# EasyEDA Pro project 数字电路实验接线.eprj

# Schematic Schematic1
Create Date: 2023-10-21; Page Name: P1; Project Name: 数字电路实验接线; Schematic Name: Schematic1; Update Date: 2023-10-21; Company: 嘉立创EDA; Page Size: A4; Version: V1.0
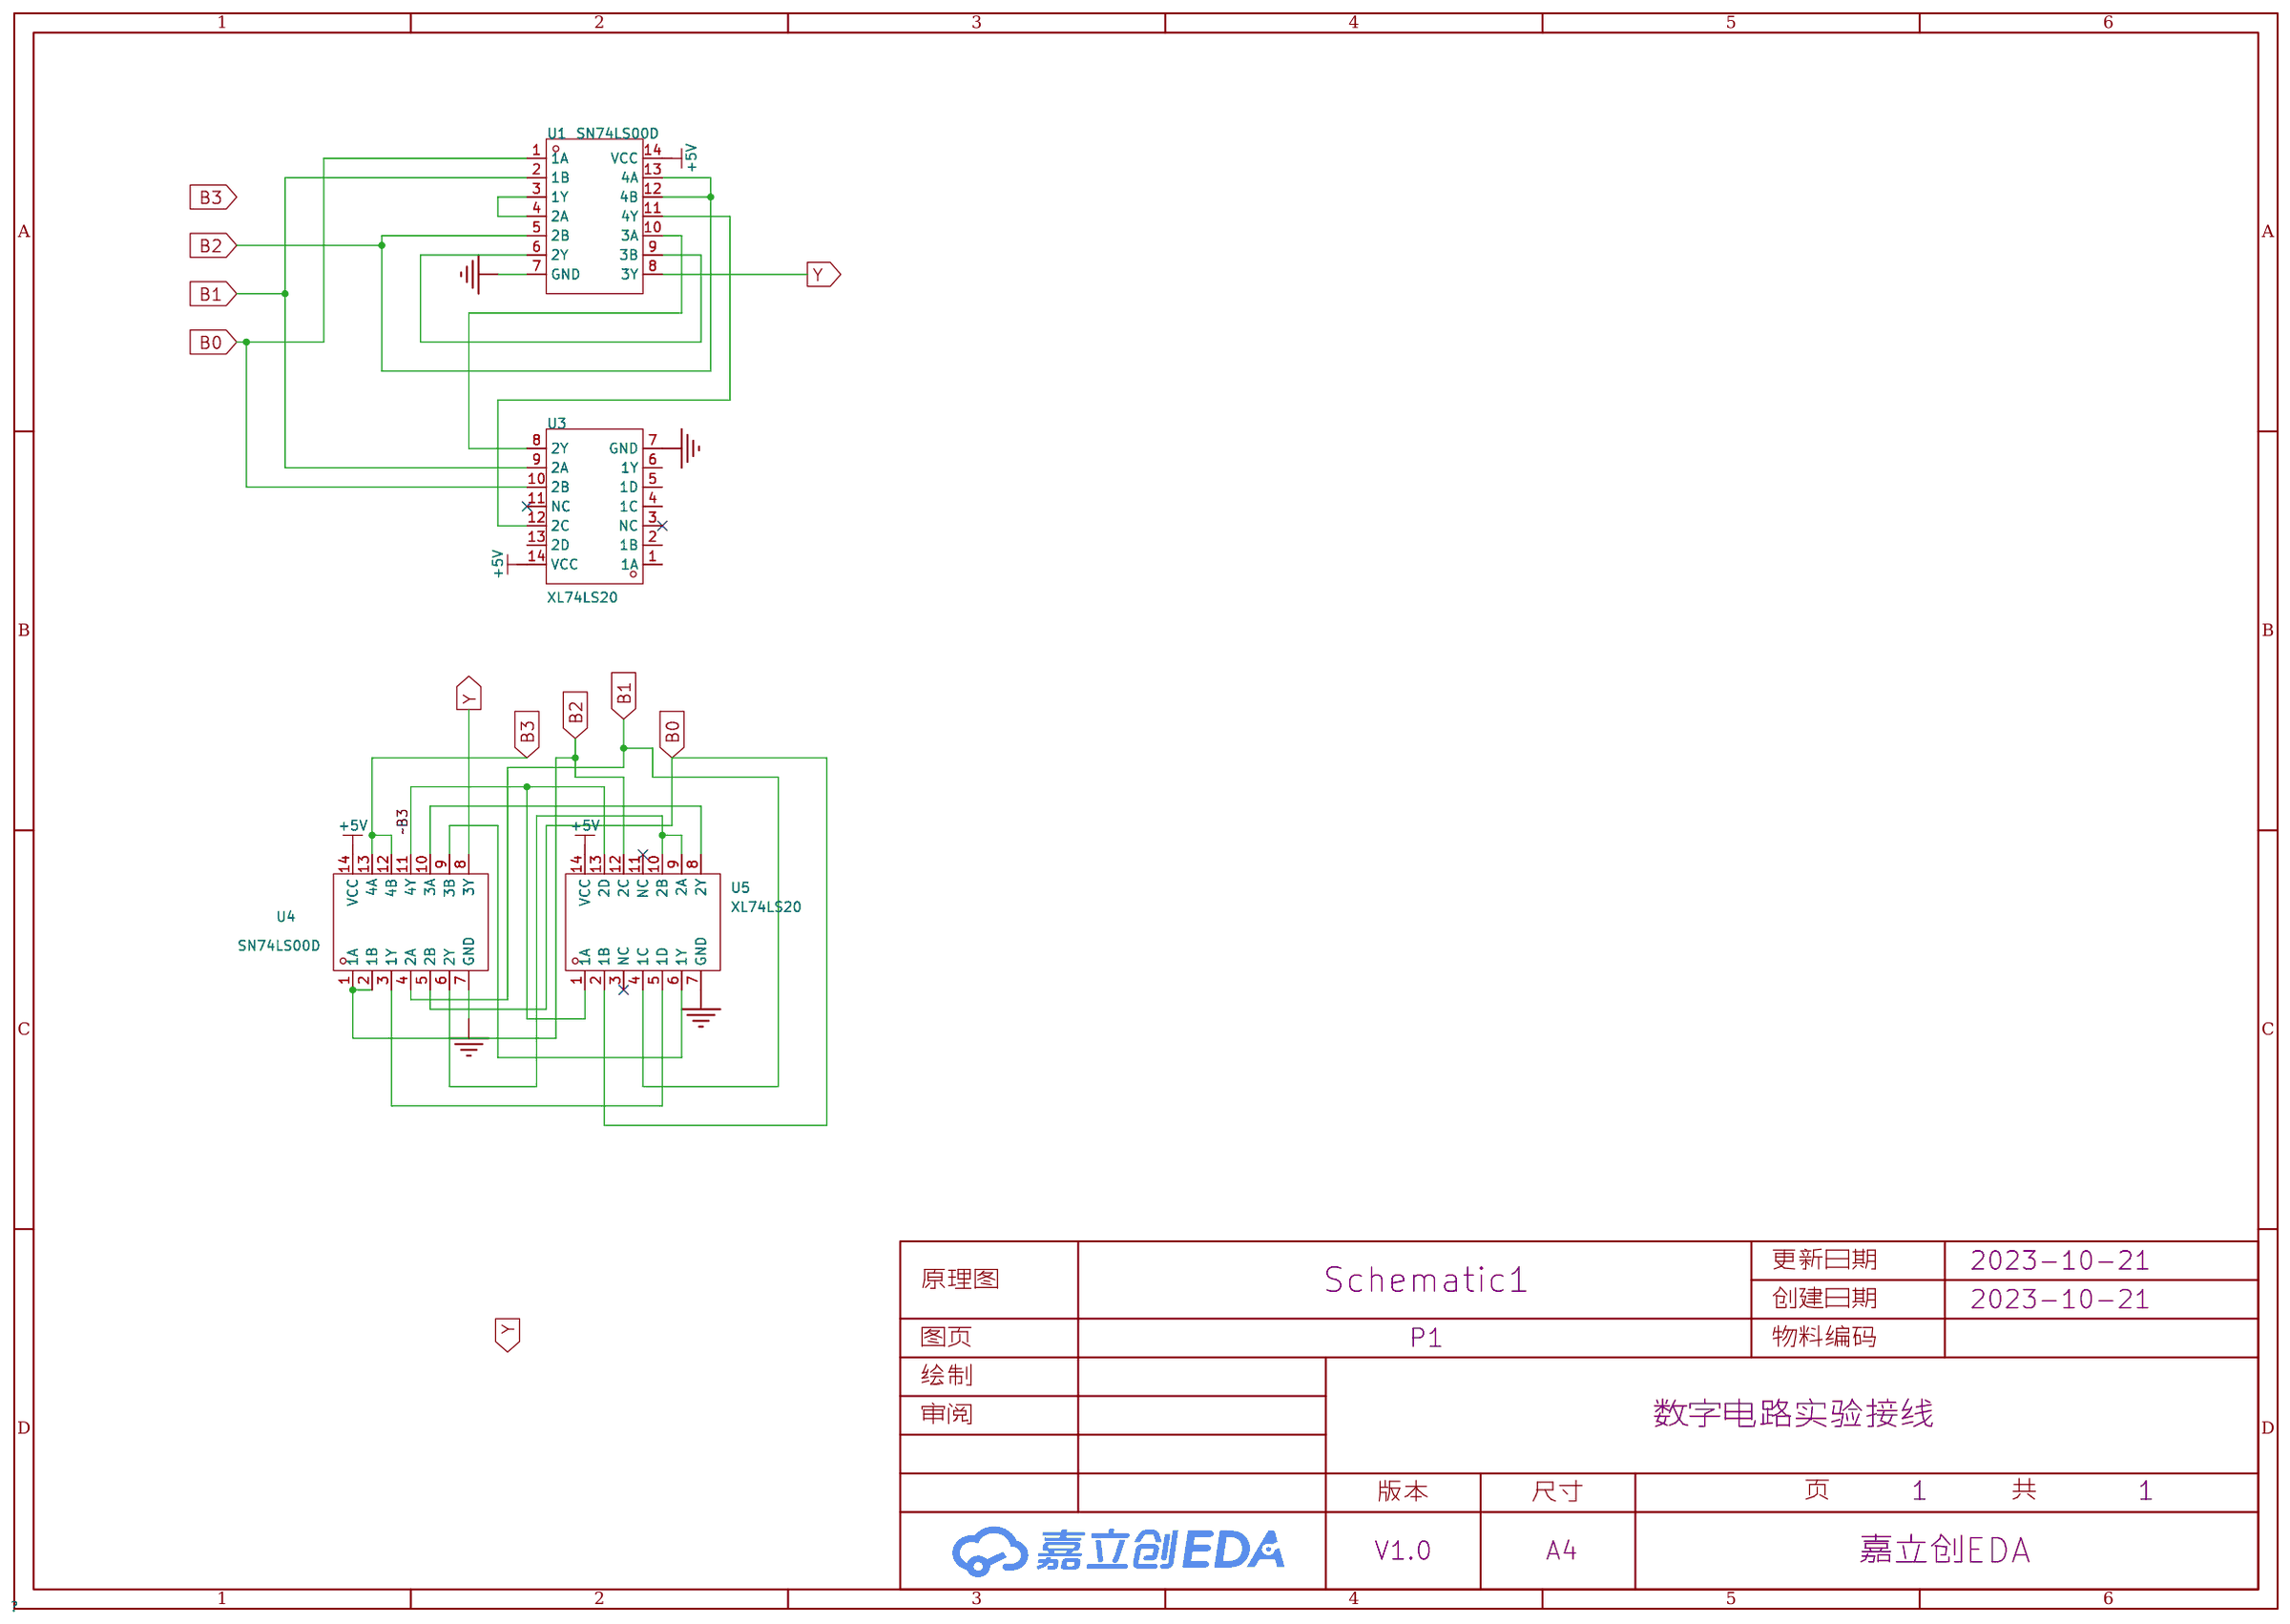
[diagram p0: schematic sheet]

## Parts
U1  SN74LS00D  [SOIC-14_L8.7-W3.9-P1.27-LS6.0-BL]
U3  XL74LS20  [SOP-14_L8.6-W3.9-P1.27-LS6.0-BL]
U4  SN74LS00D  [SOIC-14_L8.7-W3.9-P1.27-LS6.0-BL]
U5  XL74LS20  [SOP-14_L8.6-W3.9-P1.27-LS6.0-BL]

## Library data of the parts
U1 U4 = SN74LS00D: 4 通道、2 输入、4.75V 至 5.25V 双极与非门 14-SOIC 0 to 70; Supplier Part: C2872907; Manufacturer: TI(德州仪器); Supplier Footprint: SOIC-14; JLCPCB Part Class: Extended Part; Datasheet: https://atta.szlcsc.com/upload/public/pdf/source/20230221/2481733E2F3EBD7DE0CC3CA8D850DB3A.pdf; Supplier: LCSC
U3 U5 = XL74LS20: 逻辑电路的归属系列:-;逻辑类型:-;; Supplier Part: C556253; Manufacturer: XINLUDA(信路达); Supplier Footprint: SOP-14; JLCPCB Part Class: Extended Part; Datasheet: https://atta.szlcsc.com/upload/public/pdf/source/20200519/C556253_E0C015BCE649D942C076C1CD34C81B1C.pdf; Supplier: LCSC

## Nets
+5V: U1.14(VCC) U3.14(VCC) U4.14(VCC) U5.14(VCC)
GND: U1.7(GND) U3.7(GND) U4.7(GND) U5.7(GND)
B0: U1.1(1A) U3.10(2B) U4.5(2B) U5.2(1B)
B1: U1.2(1B) U3.9(2A) U4.4(2A) U5.4(1C)
B2: U1.5(2B) U1.12(4B) U1.13(4A) U4.1(1A) U4.2(1B) U5.12(2C)
B3: U4.12(4B) U4.13(4A)
Y: U1.8(3Y) U4.8(3Y)
~B3: U4.11(4Y) U5.1(1A) U5.13(2D)
Net-(U1-3): U1.3(1Y) U1.4(2A)
Net-(U1-6): U1.6(2Y) U1.9(3B)
Net-(U1-10): U1.10(3A) U3.8(2Y)
Net-(U1-11): U1.11(4Y) U3.12(2C)
Net-(U4-3): U4.3(1Y) U5.5(1D)
Net-(U4-6): U4.6(2Y) U5.9(2A) U5.10(2B)
Net-(U4-9): U4.9(3B) U5.6(1Y)
Net-(U4-10): U4.10(3A) U5.8(2Y)

Not connected (* = marked no-connect by the designer): U3 1(1A) 2(1B) 3(NC)* 4(1C) 5(1D) 6(1Y) 11(NC)* 13(2D); U5 3(NC)* 11(NC)*

# Schematic Schematic2
Create Date: 2023-10-29; Page Name: P1; Project Name: 数字电路实验接线; Schematic Name: Schematic2; Update Date: 2023-10-29; Company: 嘉立创EDA; Page Size: A4; Version: V1.0
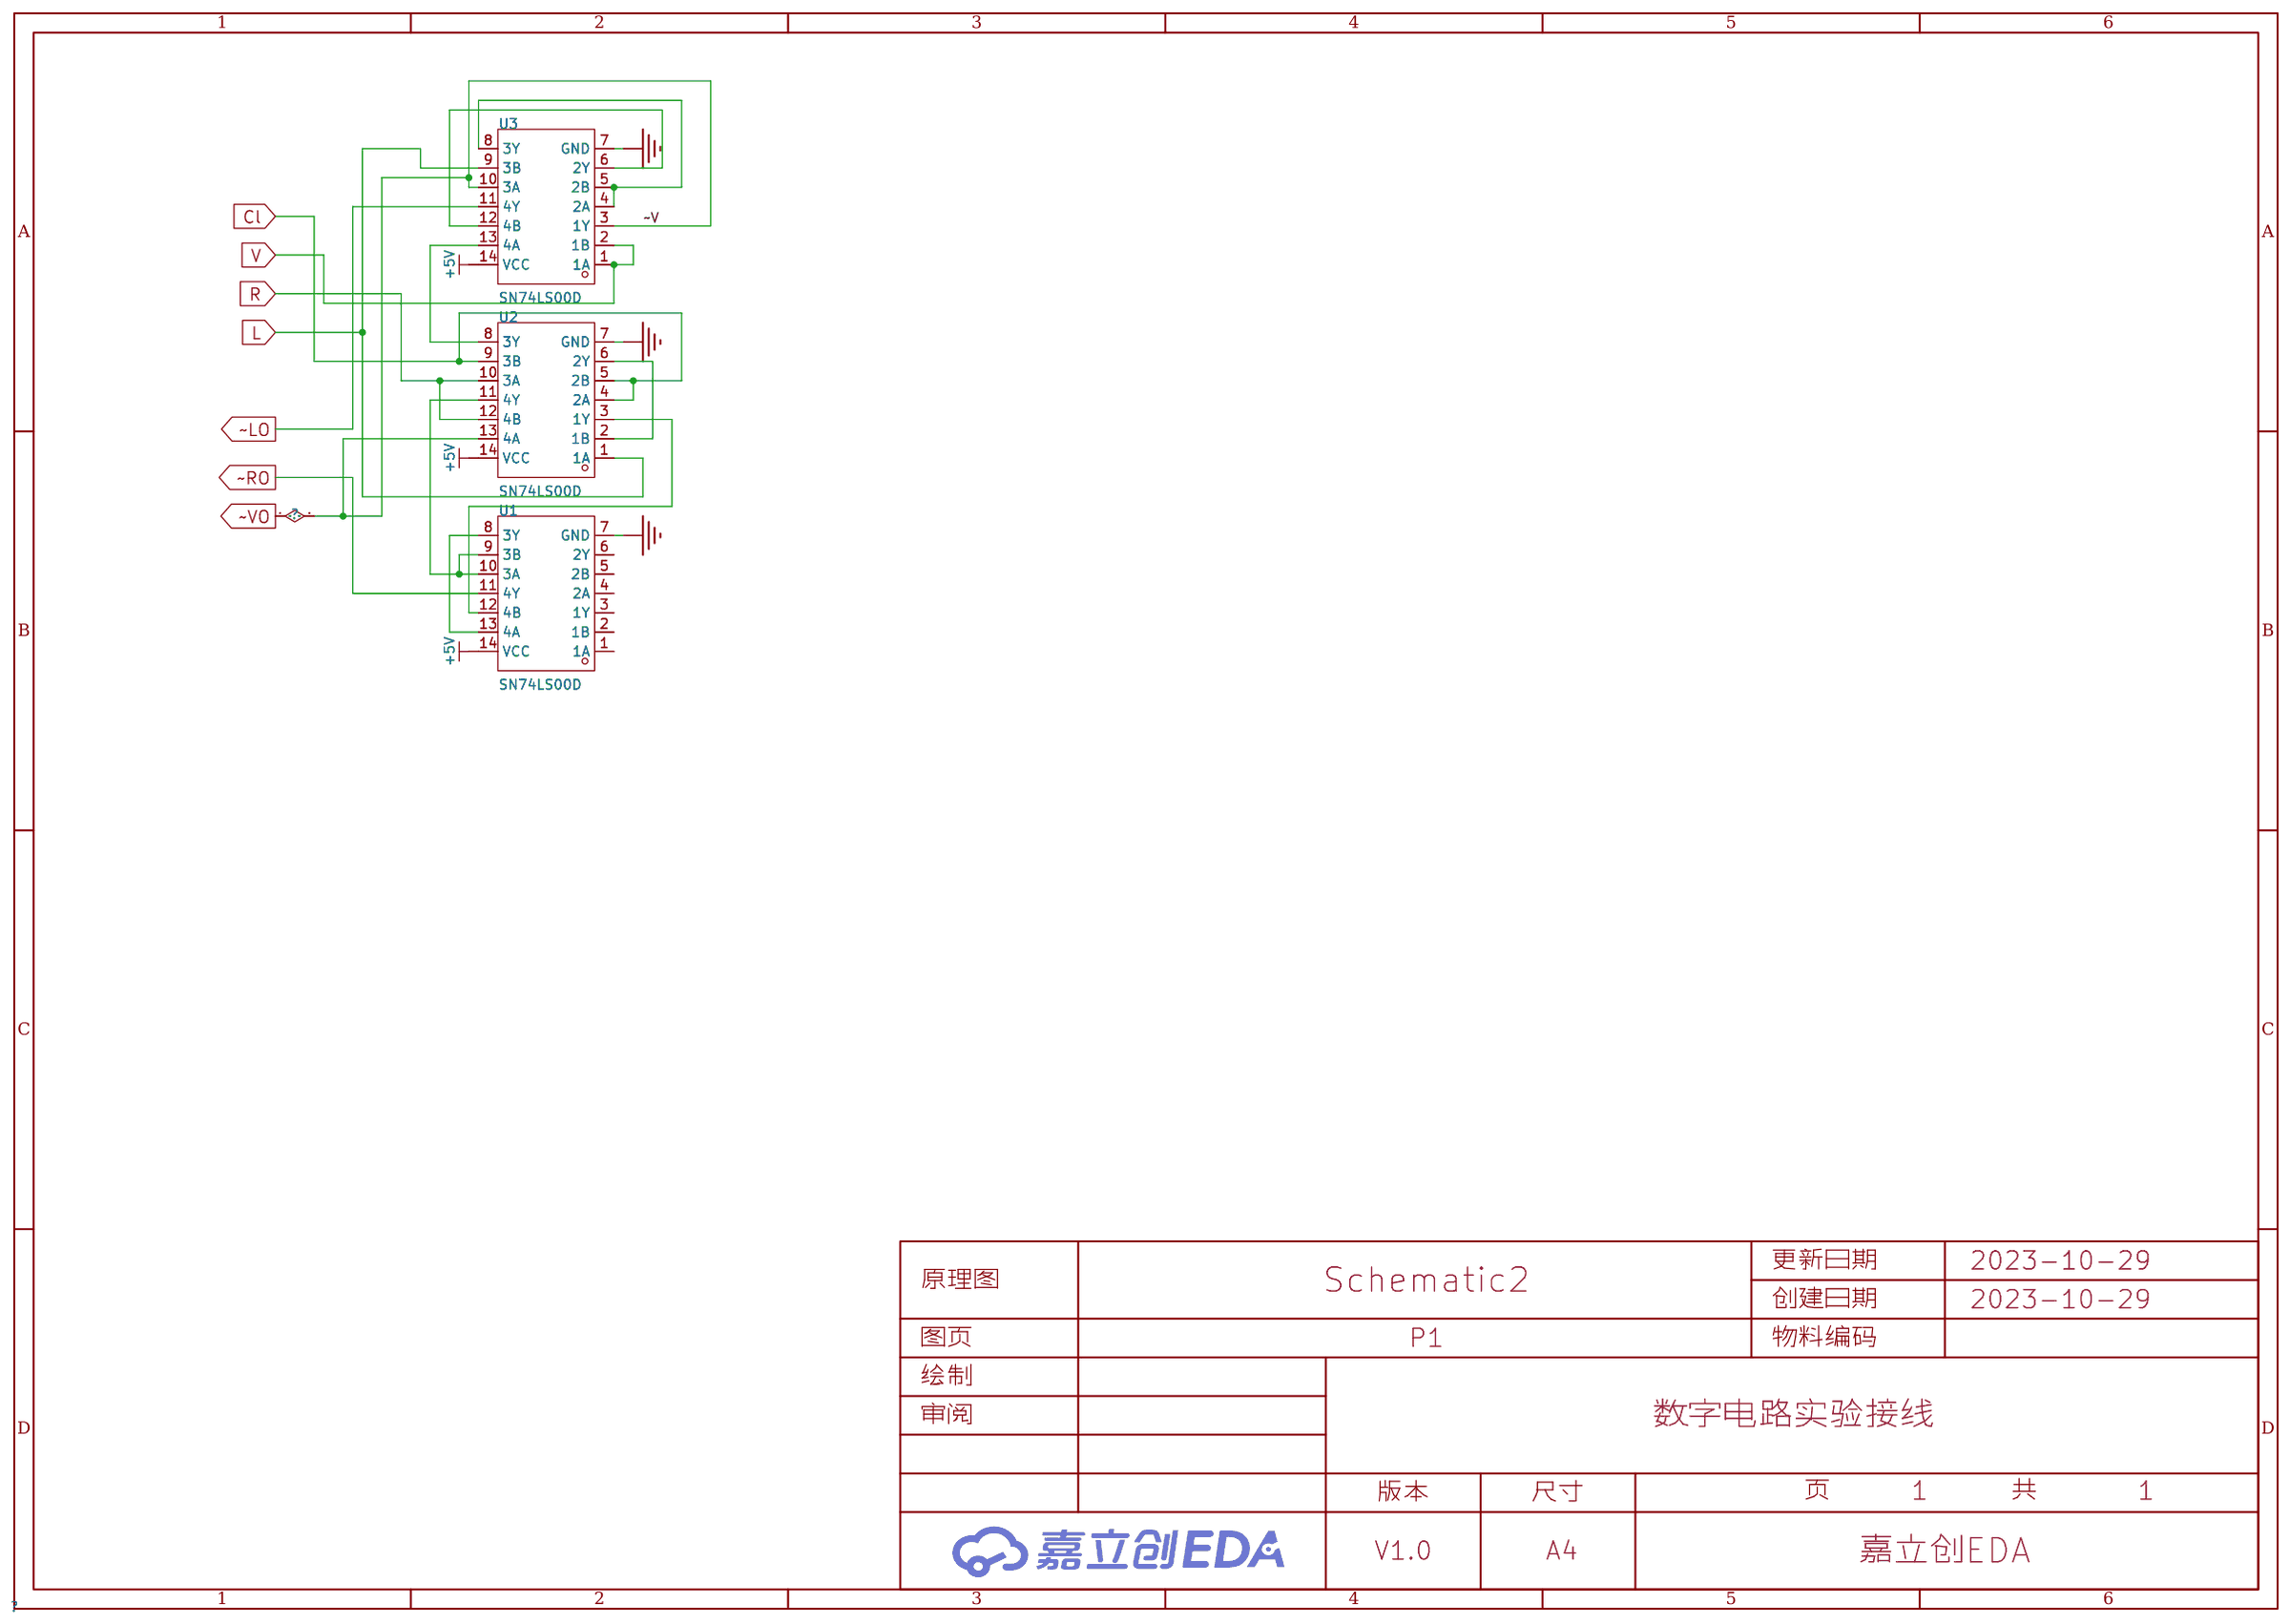
[diagram p1: schematic sheet]

## Parts
U1  SN74LS00D  [SOIC-14_L8.7-W3.9-P1.27-LS6.0-BL]
U2  SN74LS00D  [SOIC-14_L8.7-W3.9-P1.27-LS6.0-BL]
U3  SN74LS00D  [SOIC-14_L8.7-W3.9-P1.27-LS6.0-BL]

## Library data of the parts
U1-U3 = SN74LS00D: 4 通道、2 输入、4.75V 至 5.25V 双极与非门 14-SOIC 0 to 70; Supplier Part: C2872907; Manufacturer: TI(德州仪器); Supplier Footprint: SOIC-14; JLCPCB Part Class: Extended Part; Datasheet: https://atta.szlcsc.com/upload/public/pdf/source/20230221/2481733E2F3EBD7DE0CC3CA8D850DB3A.pdf; Supplier: LCSC

## Nets
+5V: U1.14(VCC) U2.14(VCC) U3.14(VCC)
GND: U1.7(GND) U2.7(GND) U3.7(GND)
Cl: U2.4(2A) U2.5(2B) U2.9(3B)
L: U2.1(1A) U3.9(3B)
R: U2.10(3A) U2.12(4B)
V: U3.1(1A) U3.2(1B)
~LO: U3.11(4Y)
~RO: U1.11(4Y)
~V: U2.13(4A) U3.3(1Y) U3.10(3A)
Net-(U1-8): U1.8(3Y) U1.13(4A)
Net-(U1-9): U1.9(3B) U1.10(3A) U2.11(4Y)
Net-(U1-12): U1.12(4B) U2.3(1Y)
Net-(U2-2): U2.2(1B) U2.6(2Y)
Net-(U2-8): U2.8(3Y) U3.13(4A)
Net-(U3-4): U3.4(2A) U3.5(2B) U3.8(3Y)
Net-(U3-6): U3.6(2Y) U3.12(4B)

Not connected (* = marked no-connect by the designer): U1 1(1A) 2(1B) 3(1Y) 4(2A) 5(2B) 6(2Y)

# Schematic Schematic3
Create Date: 2023-11-05; Page Name: P1; Project Name: 数字电路实验接线; Schematic Name: Schematic3; Update Date: 2023-11-05; Company: 嘉立创EDA; Page Size: A4; Version: V1.0
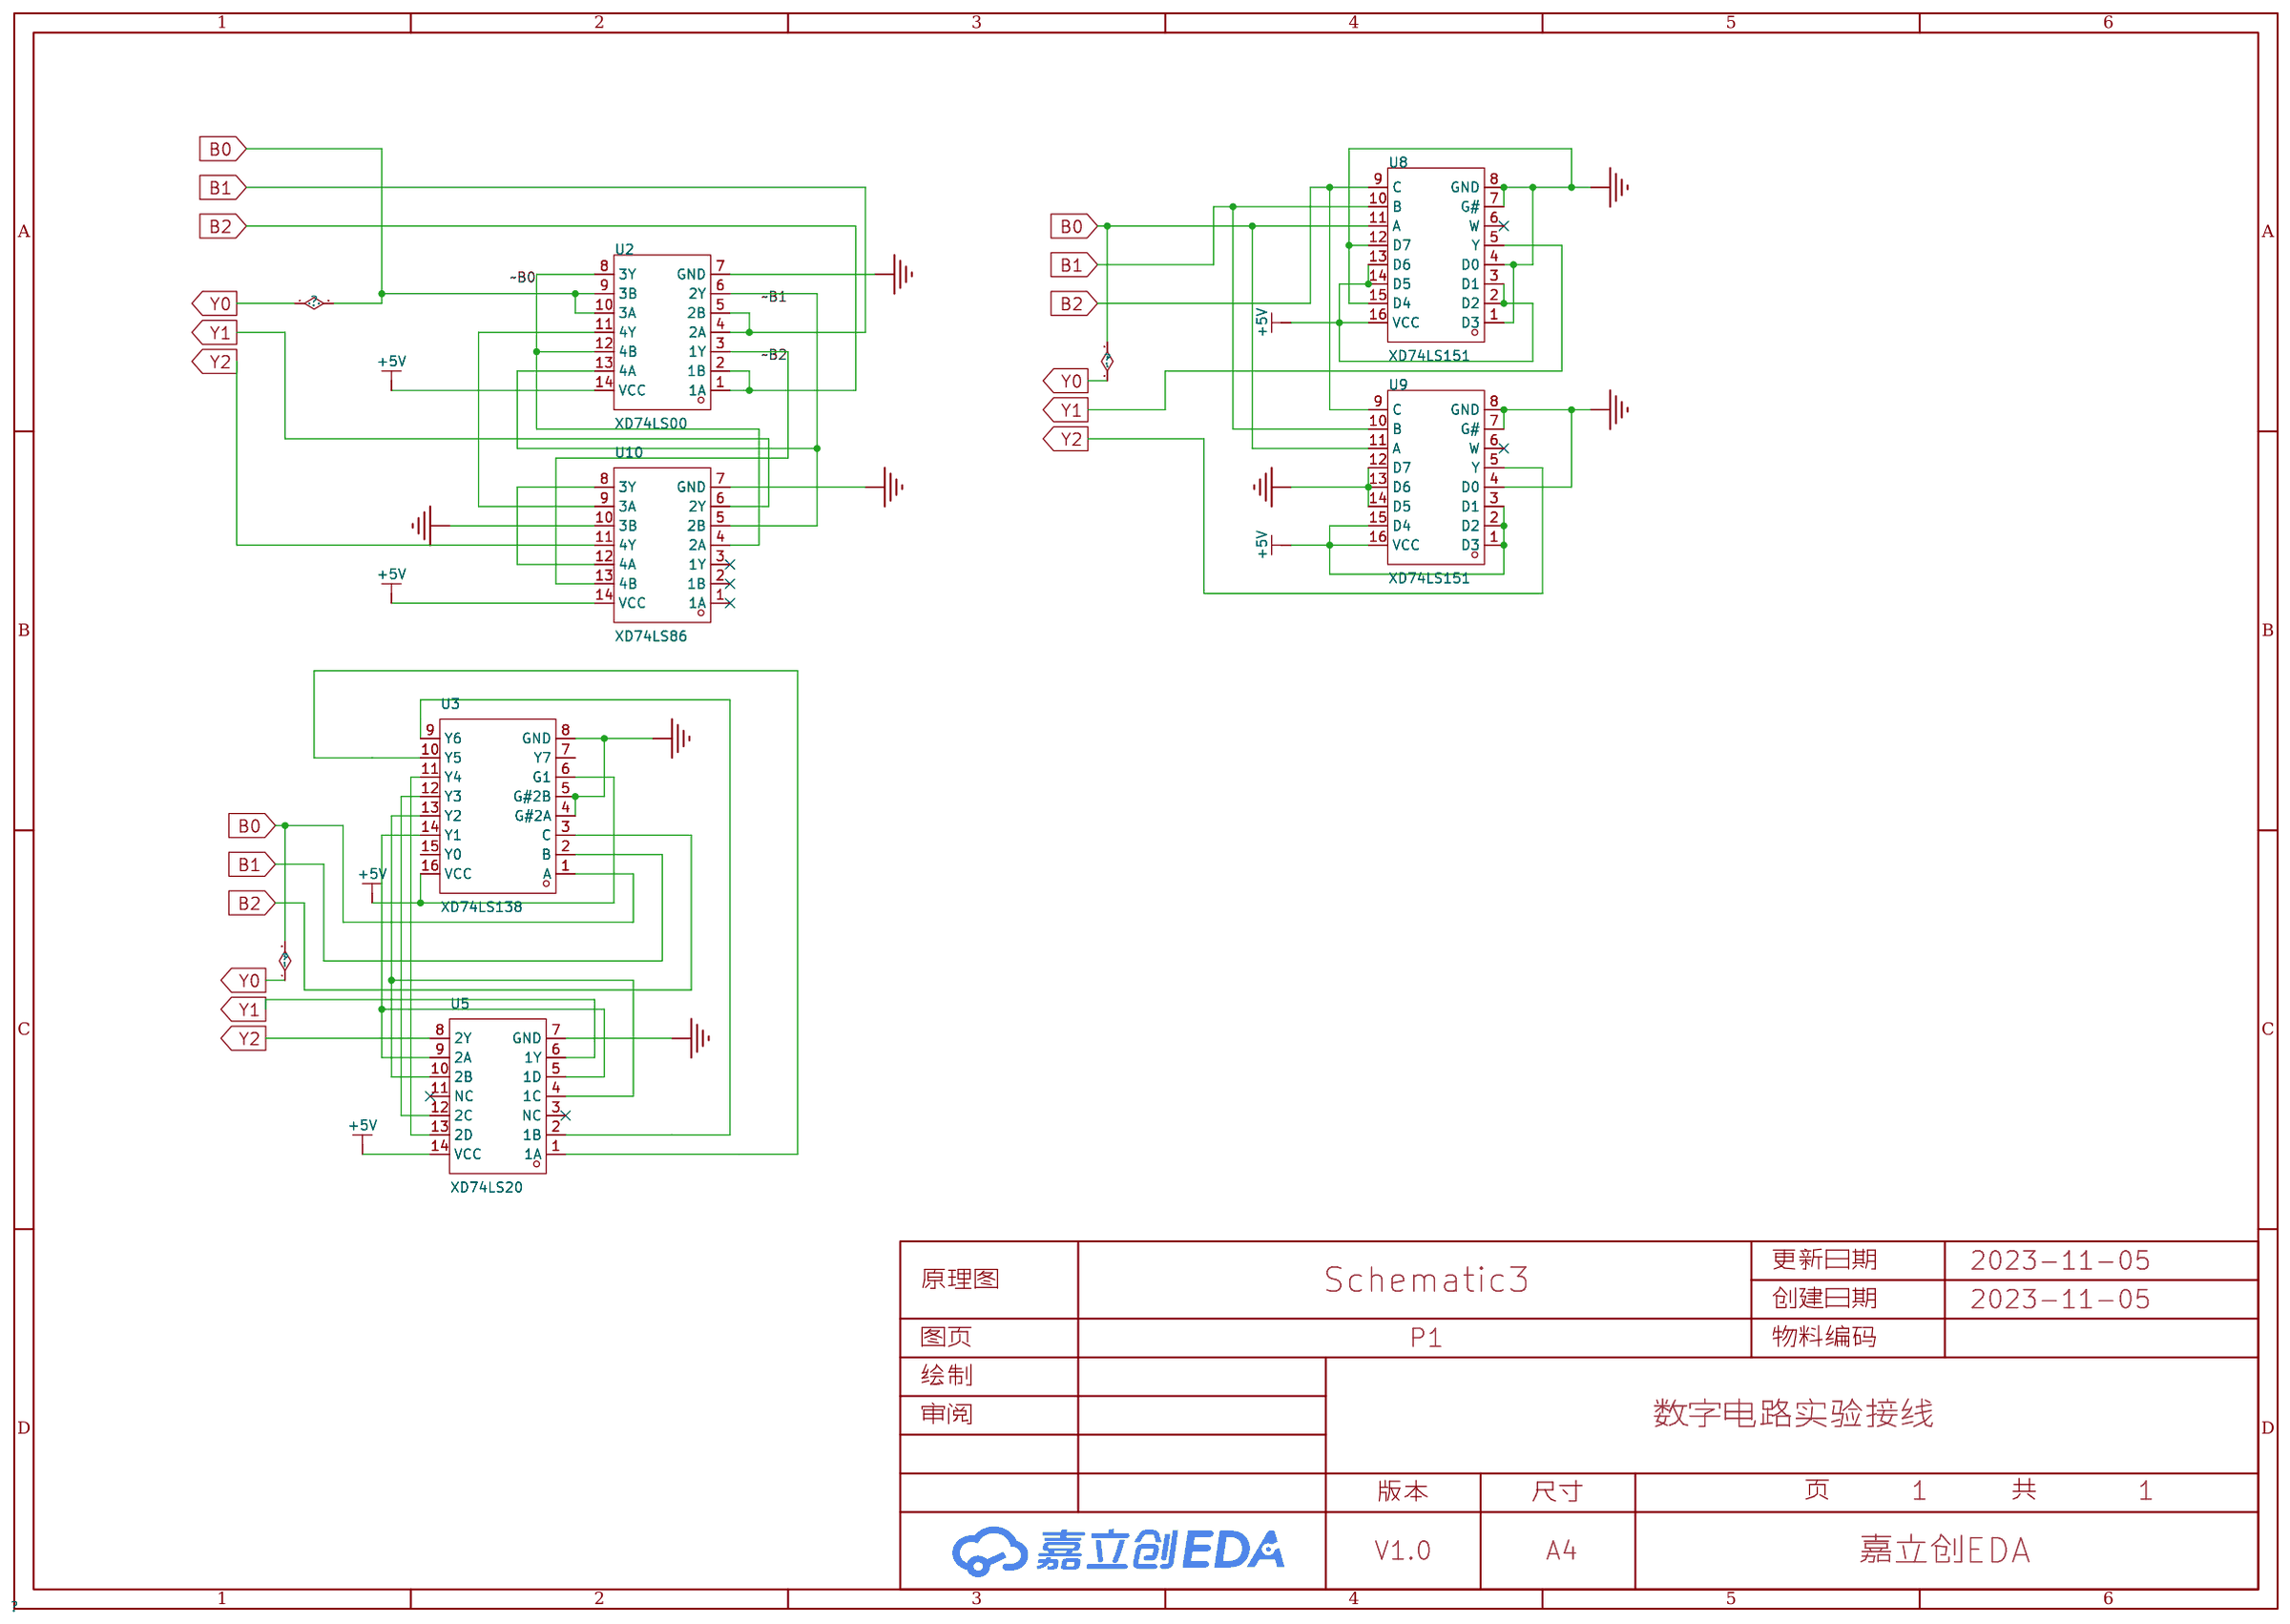
[diagram p2: schematic sheet]

## Parts
U2  XD74LS00  [DIP-14_L20.0-W7.6-P2.54-LS7.6-BL]
U3  XD74LS138  [DIP-16_L19.8-W6.5-P2.54-LS7.6-BL]
U5  XD74LS20  [DIP-14_L20.0-W7.6-P2.54-LS7.6-BL]
U8  XD74LS151  [DIP-16_L19.8-W6.5-P2.54-LS7.6-BL]
U9  XD74LS151  [DIP-16_L19.8-W6.5-P2.54-LS7.6-BL]
U10  XD74LS86  [DIP-14_L20.0-W7.6-P2.54-LS7.6-BL]

## Library data of the parts
U2 = XD74LS00: 逻辑电路的归属系列:-;逻辑类型:-;; Supplier Part: C556265; Manufacturer: XINLUDA(信路达); Supplier Footprint: DIP-14; JLCPCB Part Class: 扩展库; Datasheet: https://atta.szlcsc.com/upload/public/pdf/source/20200619/C556265_13CAEE68E18239D5629B1CE05D0196F6.pdf; Supplier: LCSC
U3 = XD74LS138: 解码器/多路解器 低电平输出电流(IOL)：8mA 高电平输出电流(IOH)：400uA 供电电源：单电源 供电电压：4.75V~5.25V 3 线路到; LCSC Part Name: 编码器、解码器、复用器和解复用器; Supplier Part: C513527; Manufacturer: XINLUDA(信路达); Supplier Footprint: DIP-16; JLCPCB Part Class: 扩展库; Datasheet: https://atta.szlcsc.com/upload/public/pdf/source/20200619/C513527_D04113946337FFA11528F3555AE2E14A.pdf; Supplier: LCSC
U5 = XD74LS20: 逻辑电路的归属系列:-;逻辑类型:-;; Supplier Part: C556254; Manufacturer: XINLUDA(信路达); Supplier Footprint: DIP-14; JLCPCB Part Class: 扩展库; Datasheet: https://atta.szlcsc.com/upload/public/pdf/source/20200519/C556253_E0C015BCE649D942C076C1CD34C81B1C.pdf; Supplier: LCSC
U8 U9 = XD74LS151: 8 线至 1 线数据选择器/多路复用器; LCSC Part Name: 编码器 解码器 复用器和解复用器; Supplier Part: C561280; Manufacturer: XINLUDA(信路达); Supplier Footprint: DIP-16; JLCPCB Part Class: 扩展库; Datasheet: https://atta.szlcsc.com/upload/public/pdf/source/20200619/C561280_FB7D50EDF574206CEC1784374CA2E447.pdf; Supplier: LCSC
U10 = XD74LS86: 逻辑电路的归属系列:-;逻辑类型:-;; Supplier Part: C556290; Manufacturer: XINLUDA(信路达); Supplier Footprint: DIP-14; JLCPCB Part Class: 扩展库; Datasheet: https://atta.szlcsc.com/upload/public/pdf/source/20211119/AC59C909E7E1A30ECC7121B301471309.pdf; Supplier: LCSC

## Nets
+5V: U2.14(VCC) U3.6(G1) U3.16(VCC) U5.14(VCC) U8.2(D2) U8.3(D1) U8.13(D6) U8.14(D5) U8.16(VCC) U9.1(D3) U9.2(D2) U9.3(D1) U9.15(D4) U9.16(VCC) U10.14(VCC)
GND: U2.7(GND) U3.4(G#2A) U3.5(G#2B) U3.8(GND) U5.7(GND) U8.1(D3) U8.4(D0) U8.7(G#) U8.8(GND) U8.12(D7) U8.15(D4) U9.4(D0) U9.7(G#) U9.8(GND) U9.12(D7) U9.13(D6) U9.14(D5) U10.7(GND) U10.10(3B)
B0: U2.9(3B) U2.10(3A) U3.1(A) U8.11(A) U9.11(A)
B1: U2.4(2A) U2.5(2B) U3.2(B) U8.10(B) U9.10(B)
B2: U2.1(1A) U2.2(1B) U3.3(C) U8.9(C) U9.9(C)
Y1: U5.6(1Y) U8.5(Y) U10.6(2Y)
Y2: U5.8(2Y) U9.5(Y) U10.11(4Y)
~B0: U2.8(3Y) U2.12(4B) U10.4(2A)
~B1: U2.6(2Y) U2.13(4A) U10.5(2B)
~B2: U2.3(1Y) U10.13(4B)
Net-(U2-11): U2.11(4Y) U10.9(3A)
Net-(U3-9): U3.9(Y6) U5.2(1B)
Net-(U3-10): U3.10(Y5) U5.1(1A)
Net-(U3-11): U3.11(Y4) U5.13(2D)
Net-(U3-12): U3.12(Y3) U5.12(2C)
Net-(U3-13): U3.13(Y2) U5.4(1C) U5.10(2B)
Net-(U3-14): U3.14(Y1) U5.5(1D) U5.9(2A)
Net-(U10-8): U10.8(3Y) U10.12(4A)

Not connected (* = marked no-connect by the designer): U3 7(Y7) 15(Y0); U5 3(NC)* 11(NC)*; U8 6(W)*; U9 6(W)*; U10 1(1A)* 2(1B)* 3(1Y)*

# Schematic Schematic3_1
Create Date: 2023-11-13; Page Name: P1; Project Name: 数字电路实验接线; Schematic Name: Schematic3_1; Update Date: 2023-11-13; Company: 嘉立创EDA; Page Size: A4; Version: V1.0
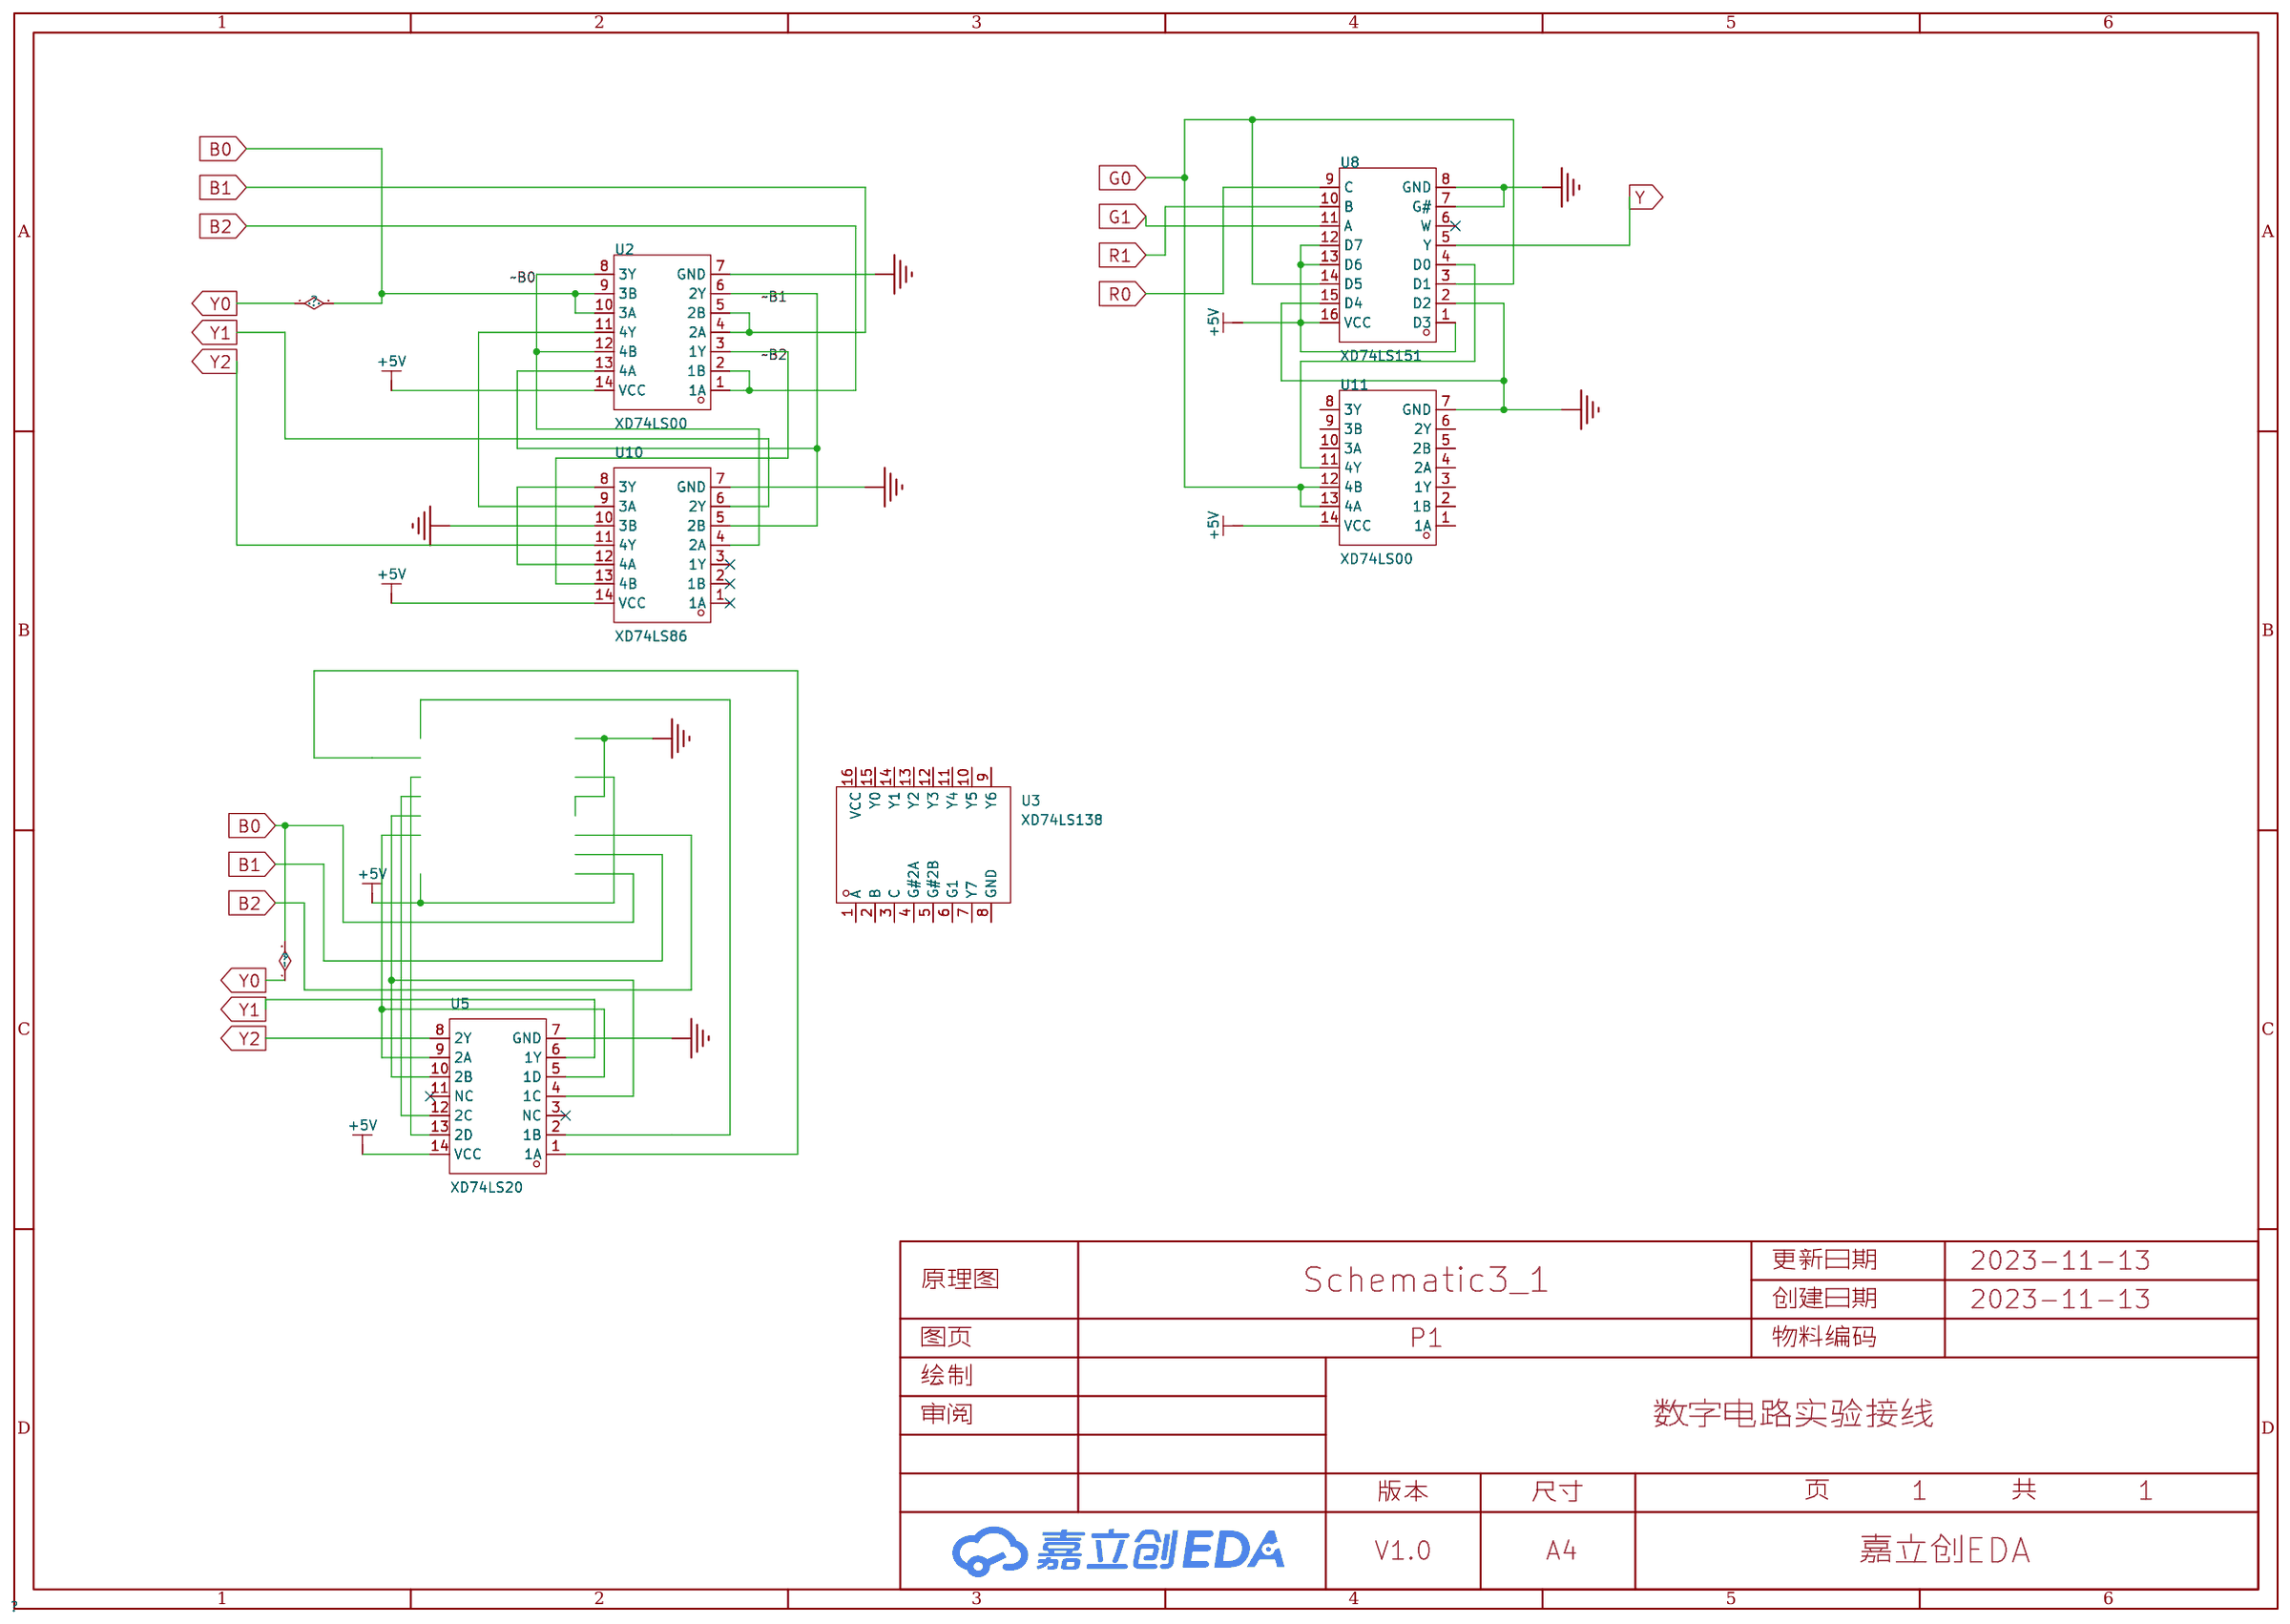
[diagram p3: schematic sheet]

## Parts
U2  XD74LS00  [DIP-14_L20.0-W7.6-P2.54-LS7.6-BL]
U3  XD74LS138  [DIP-16_L19.8-W6.5-P2.54-LS7.6-BL]
U5  XD74LS20  [DIP-14_L20.0-W7.6-P2.54-LS7.6-BL]
U8  XD74LS151  [DIP-16_L19.8-W6.5-P2.54-LS7.6-BL]
U10  XD74LS86  [DIP-14_L20.0-W7.6-P2.54-LS7.6-BL]
U11  XD74LS00  [DIP-14_L20.0-W7.6-P2.54-LS7.6-BL]

## Library data of the parts
U2 U11 = XD74LS00: 逻辑电路的归属系列:-;逻辑类型:-;; Supplier Part: C556265; Manufacturer: XINLUDA(信路达); Supplier Footprint: DIP-14; JLCPCB Part Class: 扩展库; Datasheet: https://atta.szlcsc.com/upload/public/pdf/source/20200619/C556265_13CAEE68E18239D5629B1CE05D0196F6.pdf; Supplier: LCSC
U3 = XD74LS138: 解码器/多路解器 低电平输出电流(IOL)：8mA 高电平输出电流(IOH)：400uA 供电电源：单电源 供电电压：4.75V~5.25V 3 线路到; LCSC Part Name: 编码器、解码器、复用器和解复用器; Supplier Part: C513527; Manufacturer: XINLUDA(信路达); Supplier Footprint: DIP-16; JLCPCB Part Class: 扩展库; Datasheet: https://atta.szlcsc.com/upload/public/pdf/source/20200619/C513527_D04113946337FFA11528F3555AE2E14A.pdf; Supplier: LCSC
U5 = XD74LS20: 逻辑电路的归属系列:-;逻辑类型:-;; Supplier Part: C556254; Manufacturer: XINLUDA(信路达); Supplier Footprint: DIP-14; JLCPCB Part Class: 扩展库; Datasheet: https://atta.szlcsc.com/upload/public/pdf/source/20200519/C556253_E0C015BCE649D942C076C1CD34C81B1C.pdf; Supplier: LCSC
U8 = XD74LS151: 8 线至 1 线数据选择器/多路复用器; LCSC Part Name: 编码器 解码器 复用器和解复用器; Supplier Part: C561280; Manufacturer: XINLUDA(信路达); Supplier Footprint: DIP-16; JLCPCB Part Class: 扩展库; Datasheet: https://atta.szlcsc.com/upload/public/pdf/source/20200619/C561280_FB7D50EDF574206CEC1784374CA2E447.pdf; Supplier: LCSC
U10 = XD74LS86: 逻辑电路的归属系列:-;逻辑类型:-;; Supplier Part: C556290; Manufacturer: XINLUDA(信路达); Supplier Footprint: DIP-14; JLCPCB Part Class: 扩展库; Datasheet: https://atta.szlcsc.com/upload/public/pdf/source/20211119/AC59C909E7E1A30ECC7121B301471309.pdf; Supplier: LCSC

## Nets
+5V: U2.14(VCC) U5.14(VCC) U8.1(D3) U8.12(D7) U8.13(D6) U8.16(VCC) U10.14(VCC) U11.14(VCC)
GND: U2.7(GND) U5.7(GND) U8.2(D2) U8.7(G#) U8.8(GND) U8.15(D4) U10.7(GND) U10.10(3B) U11.7(GND)
B0: U2.9(3B) U2.10(3A)
B1: U2.4(2A) U2.5(2B)
B2: U2.1(1A) U2.2(1B)
G0: U8.3(D1) U8.14(D5) U11.12(4B) U11.13(4A)
G1: U8.11(A)
R0: U8.9(C)
R1: U8.10(B)
Y: U8.5(Y)
Y1: U5.6(1Y) U10.6(2Y)
Y2: U5.8(2Y) U10.11(4Y)
~B0: U2.8(3Y) U2.12(4B) U10.4(2A)
~B1: U2.6(2Y) U2.13(4A) U10.5(2B)
~B2: U2.3(1Y) U10.13(4B)
Net-(U2-11): U2.11(4Y) U10.9(3A)
Net-(U5-4): U5.4(1C) U5.10(2B)
Net-(U5-5): U5.5(1D) U5.9(2A)
Net-(U8-4): U8.4(D0) U11.11(4Y)
Net-(U10-8): U10.8(3Y) U10.12(4A)

Not connected (* = marked no-connect by the designer): U3 1(A) 2(B) 3(C) 4(G#2A) 5(G#2B) 6(G1) 7(Y7) 8(GND) 9(Y6) 10(Y5) 11(Y4) 12(Y3) 13(Y2) 14(Y1) 15(Y0) 16(VCC); U5 1(1A) 2(1B) 3(NC)* 11(NC)* 12(2C) 13(2D); U8 6(W)*; U10 1(1A)* 2(1B)* 3(1Y)*; U11 1(1A) 2(1B) 3(1Y) 4(2A) 5(2B) 6(2Y) 8(3Y) 9(3B) 10(3A)

# Board PCB1
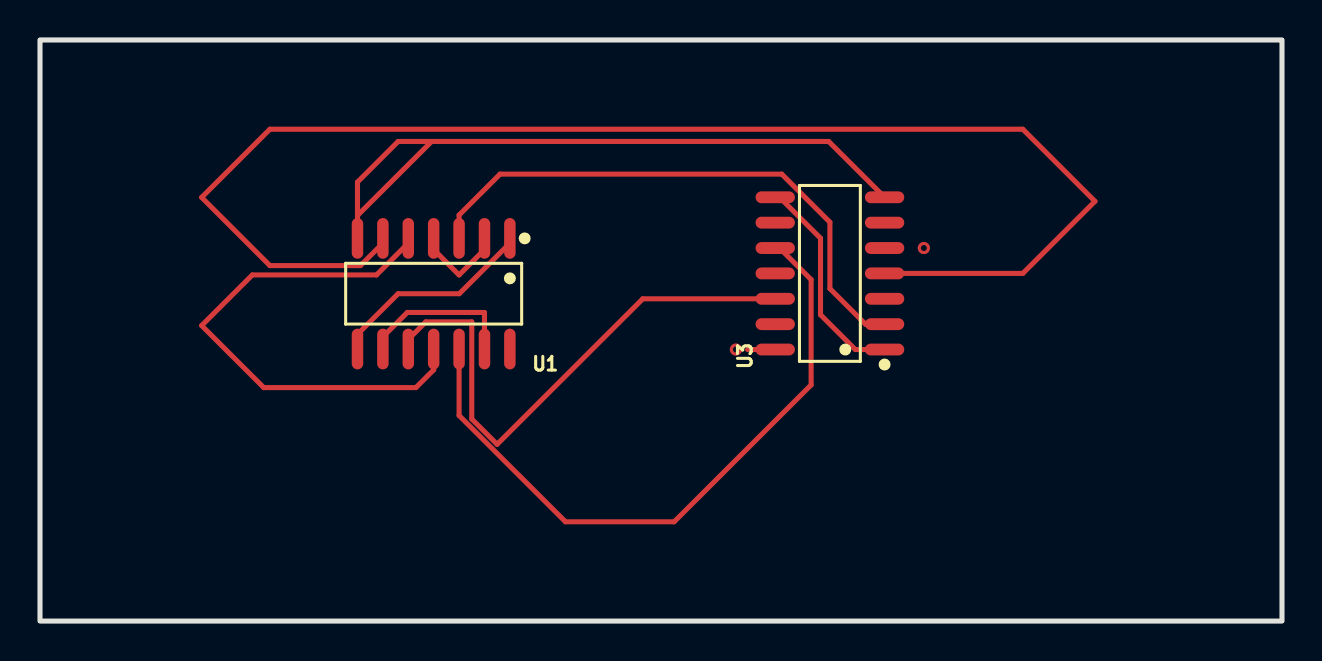
[diagram p4: board, top side]
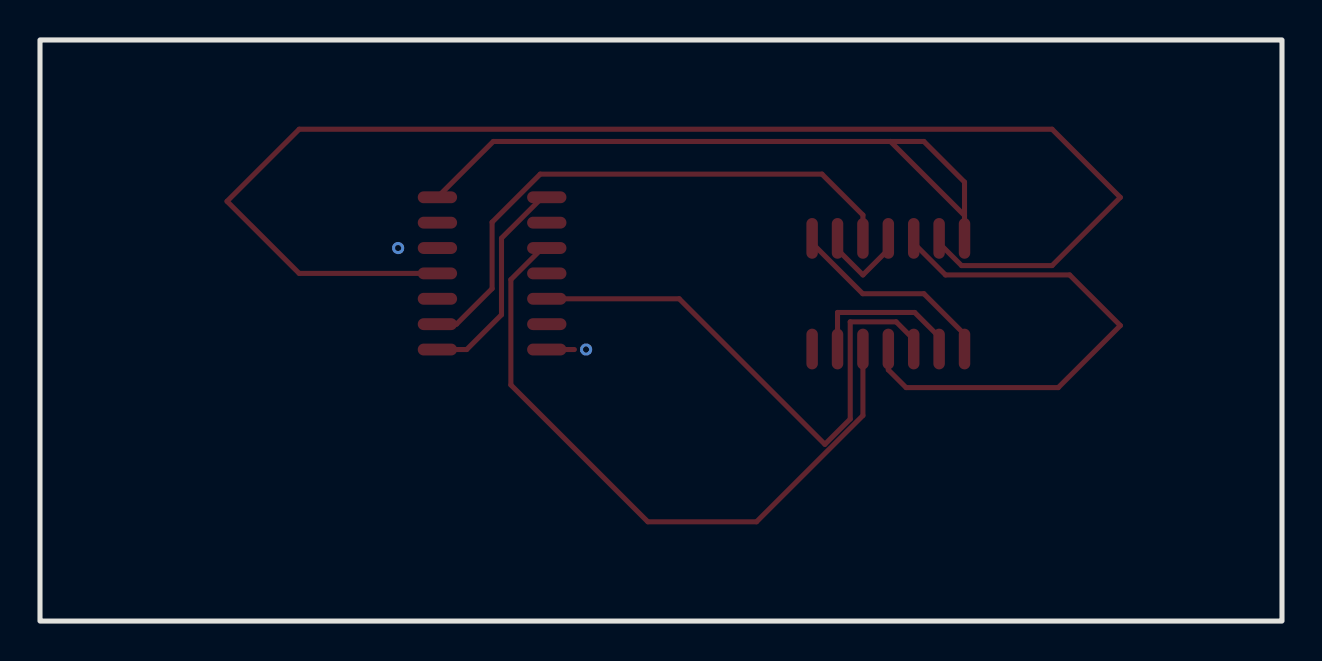
[diagram p5: board, bottom side, seen from below]

Outline 62.1 x 29.08 mm; copper layers: Top Layer, Bottom Layer. Coordinates in mm from the lower left corner of the outline.
Outline path: rectangle 0,29.08 62.1,0
Stack: Top Layer 0.035mm / Dielectric1 1.51mm FR4 er 4.5 / Bottom Layer 0.035mm

## Design rules (mm)
template: JLCPCB Capability(Two Layers Board)
spacing copperThickness1oz (default): track to track 0.102, other pairs 0.152 to 0.3
spacing copperThickness2oz: track to track 0.203, other pairs 0.152 to 0.3
track width copperThickness1oz (default): min 0.127, default 0.254, max 2.54
track width copperThickness2oz: min 0.203, default 0.254, max 2.54
differential pair differentialPair (default): width min 0.127, default 0.254, max 2.54; gap min 0.152, default 0.152
via viaSize (default): diameter min 0.5, default 0.61, max 10; hole min 0.3, default 0.305, max 6.3

## Placement (name value [footprint] x y rotation side)
U1  SN74LS00D  [SOIC-14_L8.7-W3.9-P1.27-LS6.0-BL]  19.69 16.38 180 top
U3  XL74LS20  [SOP-14_L8.6-W3.9-P1.27-LS6.0-BL]  39.5 17.4 90 top

## Footprints (pads in the part's own frame, mm; a bottom-side part is the same pattern mirrored in y, then rotated)
SOIC-14_L8.7-W3.9-P1.27-LS6.0-BL
  oval 0.574x2.038 smd: 1(-3.81,-2.769) 2(-2.54,-2.769) 3(-1.27,-2.769) 4(0,-2.769) 5(1.27,-2.769) 6(2.54,-2.769) 7(3.81,-2.769) 8(3.81,2.769) 9(2.54,2.769) 10(1.27,2.769) 11(0,2.769) 12(-1.27,2.769) 13(-2.54,2.769) 14(-3.81,2.769)
SOP-14_L8.6-W3.9-P1.27-LS6.0-BL
  oval 0.595x1.968 smd: 1(-3.81,-2.734) 2(-2.54,-2.734) 3(-1.27,-2.734) 4(0,-2.734) 5(1.27,-2.734) 6(2.54,-2.734) 7(3.81,-2.734) 8(3.81,2.734) 9(2.54,2.734) 10(1.27,2.734) 11(0,2.734) 12(-1.27,2.734) 13(-2.54,2.734) 14(-3.81,2.734)

## Nets
+5V: U1.9 U1.13 U1.14 U3.5 U3.13 U3.14
GND: U1.7 U3.7
B0: U1.10 U3.12
B1: U1.12 U3.10
B2: U1.2 U1.4
Y: U3.6
~B0: U1.1 U1.8
~B1: U1.5 U1.11
~B2: U3.9
$1N911: U3.1 U3.8
$1N930: U1.3 U3.2
$1N997: U1.6 U3.4

Pads without a net: U3 3 11

## Via types
v1: diameter 0.61, hole 0.305, Top Layer to Bottom Layer, 2 vias

## Routing (per net, layer and track width the routed paths; a pad name or vN(x,y) marks a point on that pad's centre or on a via; arc(x,y) is an arc through that point)
+5V: length 9.4
  Top Layer w0.254: U3.14 35.38,13.59 ; U1.13 22.22,15.44 18.37,15.44 17.15,14.22 U1.9
GND: length 36.4
  Top Layer w0.254: 15.88,20.3 U1.7 ; 15.88,20.3 15.88,21.97 17.91,24 19.58,24 ; 15.88,20.3 19.58,24 ; 19.58,24 39.44,24 U3.7
(no net):
  vias: v1(34.8,13.59) v1(44.2,18.67)
B0: length 27.6
  Top Layer w0.254: U1.10 18.41,14.1 19.29,14.98 21.59,14.98 21.59,10.11 22.86,8.84 30.14,16.13 U3.12
B1: length 33.7
  Top Layer w0.254: U1.12 20.96,10.29 26.28,4.97 31.71,4.97 38.56,11.82 38.56,17.09 36.98,18.67 U3.10
B2: length 4.7
  Top Layer w0.254: U1.2 22.22,18.59 20.96,17.32 19.69,18.59 U1.4
~B0: length 10.5
  Top Layer w0.254: U1.8 15.88,14.35 17.91,16.38 20.97,16.38 23.5,18.91 U1.1
~B1: length 26.6
  Top Layer w0.254: U1.5 18.41,18.91 16.82,17.32 10.62,17.32 8.08,14.79 11.19,11.68 18.8,11.68 19.69,12.57 U1.11
$1N911: length 10.9
  Top Layer w0.254: U3.8 36.98,21.21 39.03,19.16 39.03,15.33 40.77,13.59 U3.1
$1N930: length 28.3
  Top Layer w0.254: 42.23,14.86 41.28,14.86 39.5,16.64 39.5,19.96 37.09,22.37 23,22.37 20.96,20.32 U1.3
$1N997: length 70.8
  Top Layer w0.254: U3.4 49.14,17.4 52.75,21.01 49.14,24.62 11.5,24.62 8.08,21.2 11.5,17.79 16.02,17.79 17.15,18.91 U1.6
